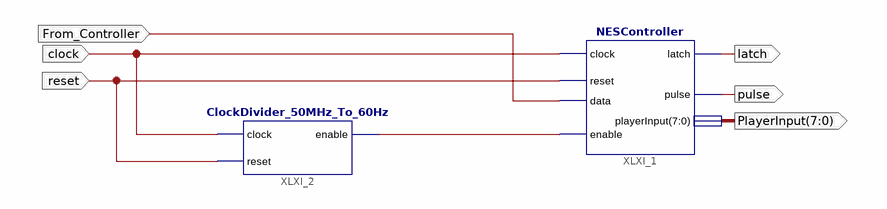
[diagram p0: schematic sheet 1]
// Xilinx ISE schematic NES_To_LED.sch (spartan3e) as structural Verilog: 2 symbols, 6 ports
module NES_To_LED (
  input  clock,
  input  reset,
  input  From_Controller,
  output latch,
  output pulse,
  output [7:0] PlayerInput
);

  wire XLXN_12;

  NESController XLXI_1 (
    .clock(clock), .latch(latch), .pulse(pulse), .playerInput(PlayerInput), .reset(reset),
    .data(From_Controller), .enable(XLXN_12));
  ClockDivider_50MHz_To_60Hz XLXI_2 (.clock(clock), .reset(reset), .enable(XLXN_12));
endmodule
